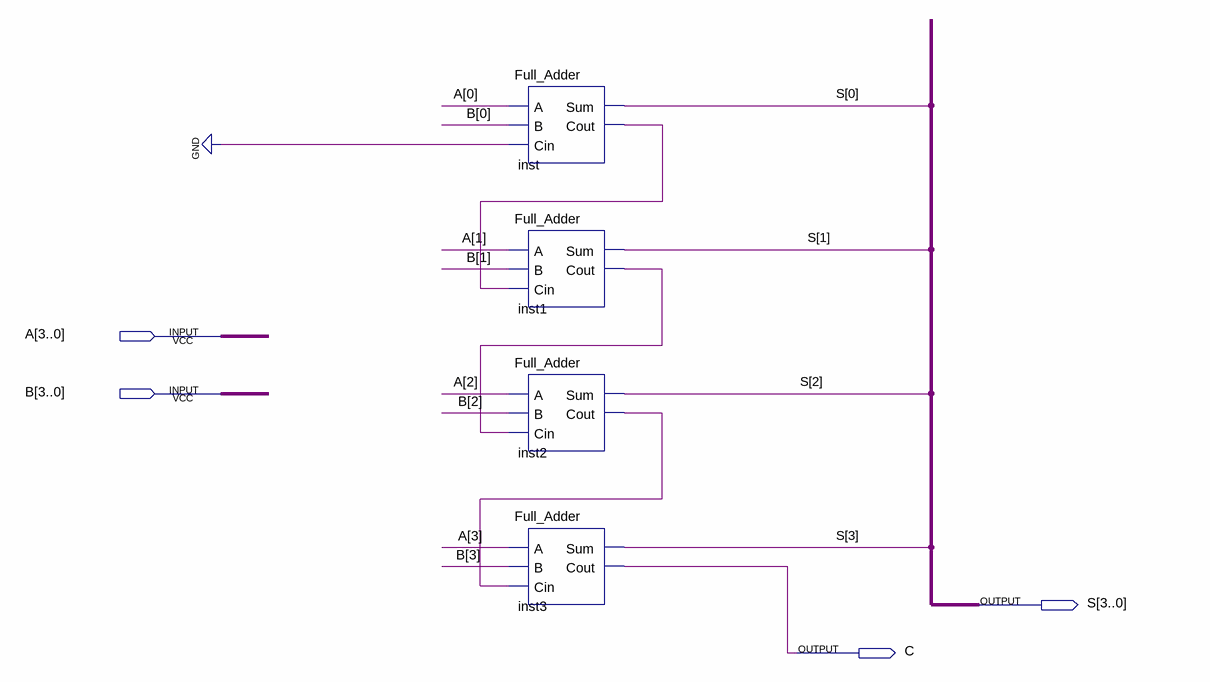
[diagram p0: schematic sheet]
// Quartus schematic Adder_4bit.bdf as structural Verilog: 4 symbols, 4 pins
module Adder_4bit (
  input  [3:0] A,
  input  [3:0] B,
  output [3:0] S,
  output C
);

  wire inst1_cout, inst2_cout, inst_cout;

  Full_Adder inst (.A(A[0]), .B(B[0]), .Cin(1'b0), .Sum(S[0]), .Cout(inst_cout));
  Full_Adder inst1 (.A(A[1]), .B(B[1]), .Cin(inst_cout), .Sum(S[1]), .Cout(inst1_cout));
  Full_Adder inst2 (.A(A[2]), .B(B[2]), .Cin(inst1_cout), .Sum(S[2]), .Cout(inst2_cout));
  Full_Adder inst3 (.A(A[3]), .B(B[3]), .Cin(inst2_cout), .Sum(S[3]), .Cout(C));
endmodule
